# Altium project Gamebuino.PrjPcb
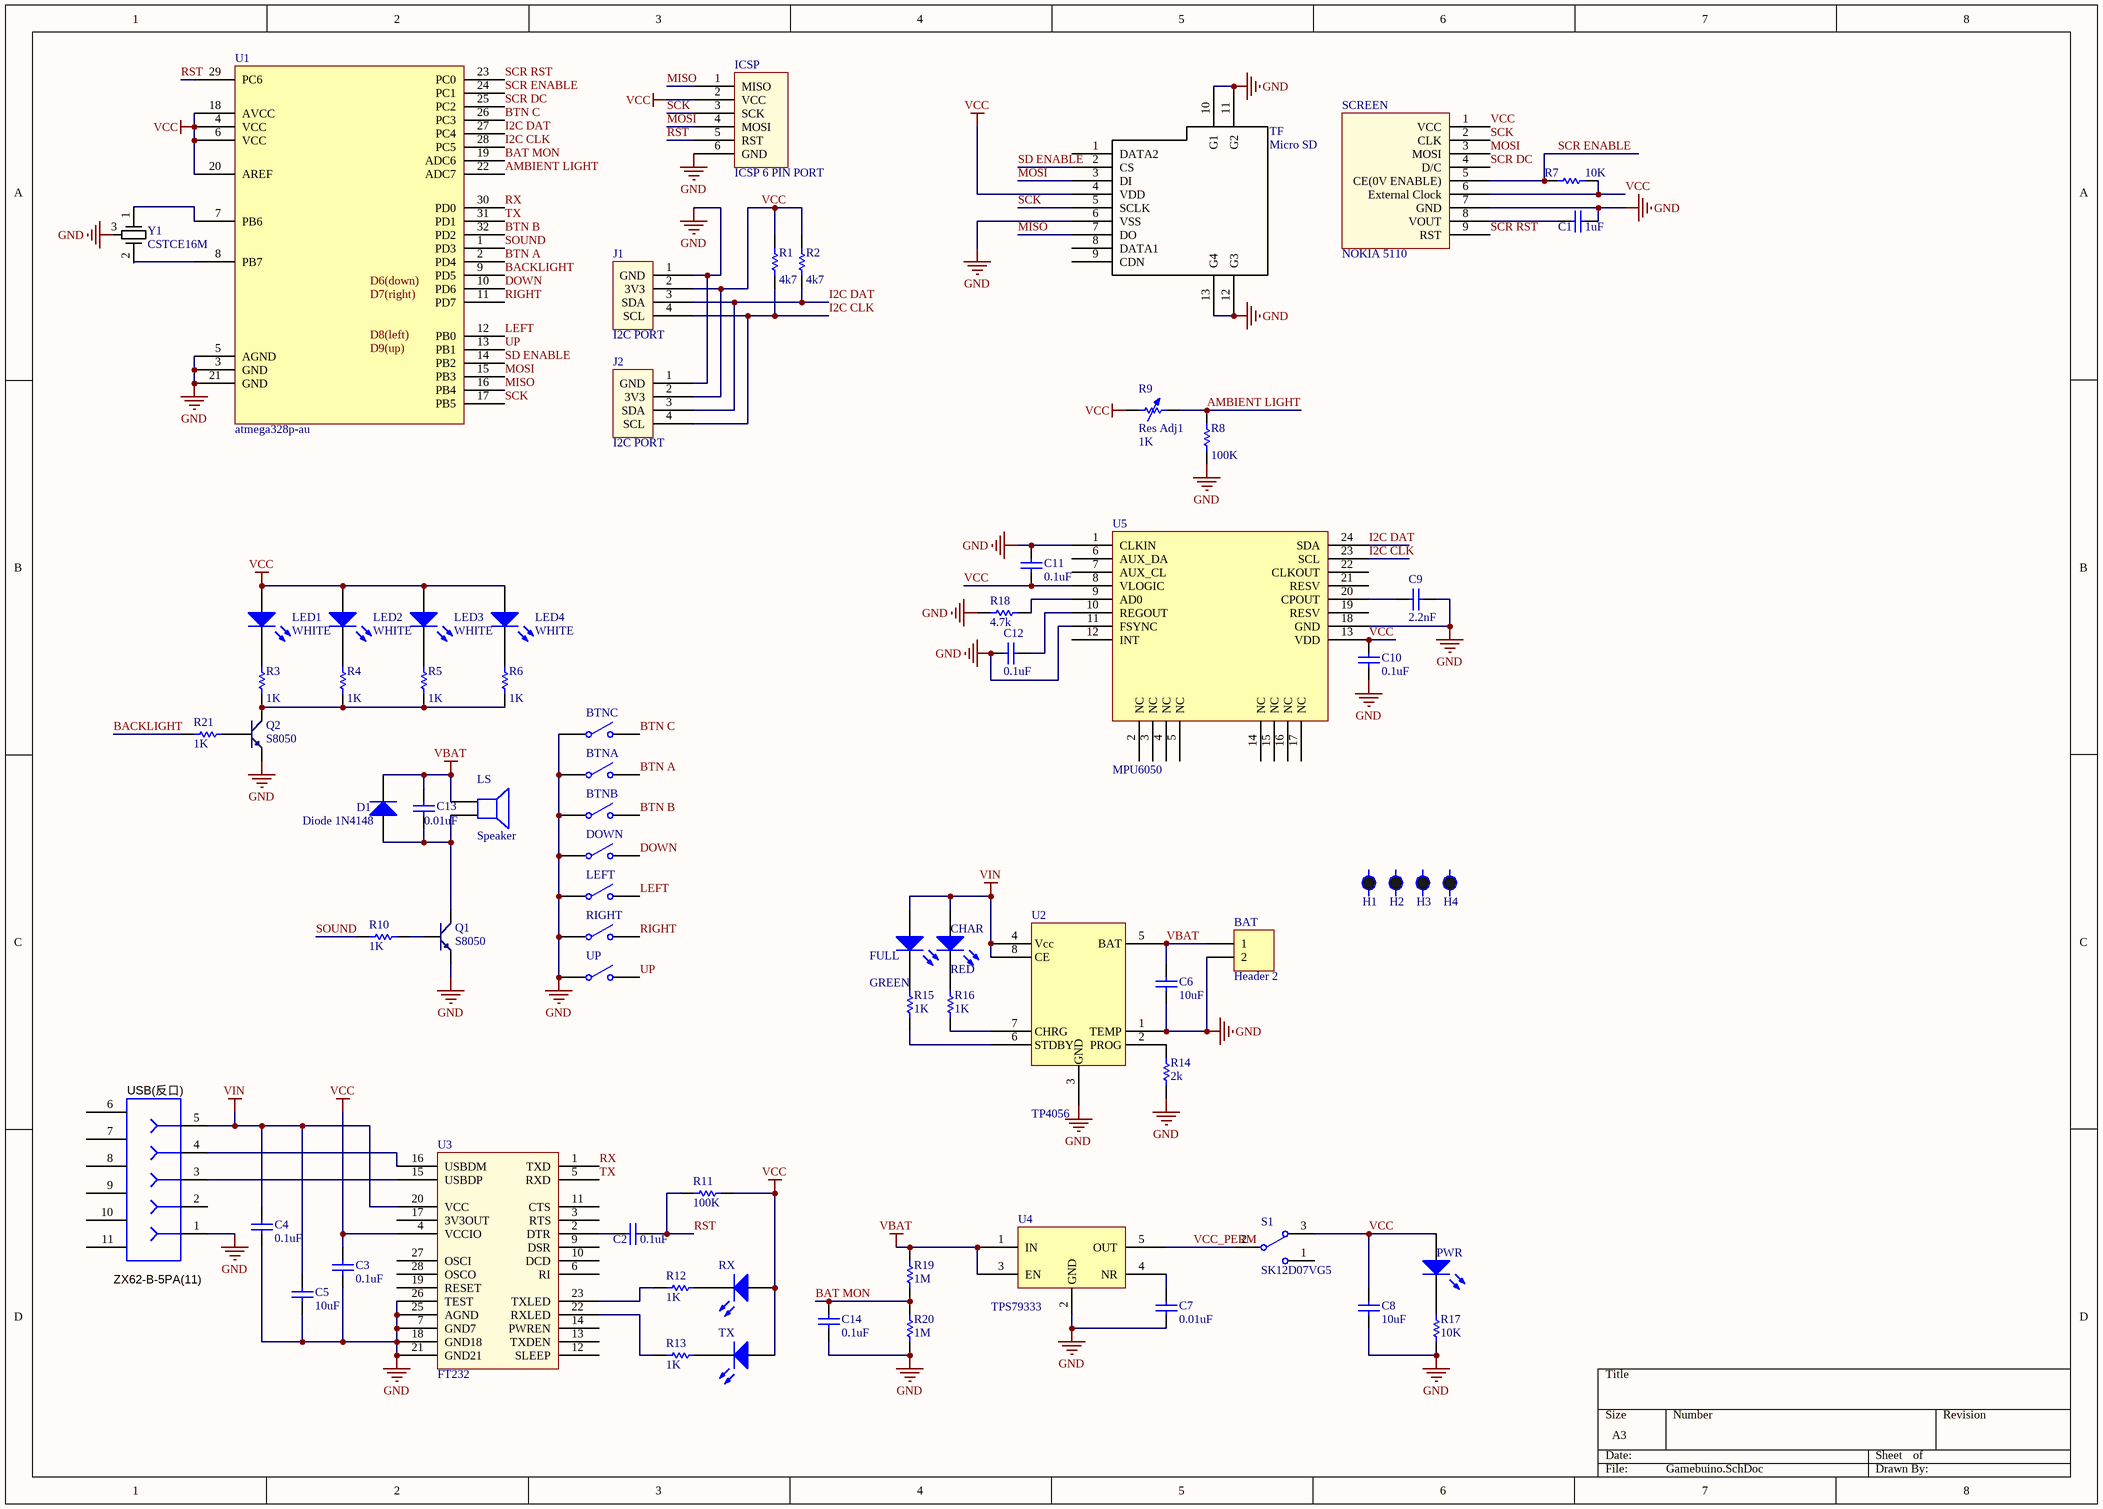
[diagram p0: Gamebuino.SchDoc]
1 sheet, 73 parts. Net scope: global (net labels, ports and power ports of the same name join across sheets).
Board file: Gamebuino.PcbDoc

## Sheet Gamebuino.SchDoc
size A3

### Parts
BAT  Header 2  [BAT]
BTNA  SW-SPST  [KEY5]  (value not drawn)
BTNB  SW-SPST  [KEY5]  (value not drawn)
BTNC  SW-SPST  [KEY5]  (value not drawn)
C1  value 1uF  [6-0805_N]  (hidden comment: Cap)
C2  value 0.1uF  [6-0805_N]  (hidden comment: Cap)
C3  value 0.1uF  [6-0805_N]  (hidden comment: Cap)
C4  value 0.1uF  [6-0805_N]  (hidden comment: Cap)
C5  value 10uF  [6-0805_N]  (hidden comment: Cap)
C6  value 10uF  [6-0805_N]  (hidden comment: Cap)
C7  value 0.01uF  [6-0805_N]  (hidden comment: Cap)
C8  value 10uF  [6-0805_N]  (hidden comment: Cap)
C9  value 2.2nF  [6-0805_N]  (hidden comment: Cap)
C10  value 0.1uF  [6-0805_N]  (hidden comment: Cap)
C11  value 0.1uF  [6-0805_N]  (hidden comment: Cap)
C12  value 0.1uF  [6-0805_N]  (hidden comment: Cap)
C13  value 0.01uF  [6-0805_N]  (hidden comment: Cap)
C14  value 0.1uF  [6-0805_N]  (hidden comment: Cap)
CHAR  RED  [6-0805_N]
D1  Diode 1N4148  [12Z-2010]
DOWN  SW-SPST  [KEY5]  (value not drawn)
FULL  GREEN  [6-0805_N]
H1  HOLE  [HOLE_3.0]  (value not drawn)
H2  HOLE  [HOLE_3.0]  (value not drawn)
H3  HOLE  [HOLE_3.0]  (value not drawn)
H4  HOLE  [HOLE_3.0]  (value not drawn)
ICSP  ICSP 6 PIN PORT  [CONN6-1mm]
J1  I2C PORT  [CONN4_/wTestPoint]
J2  I2C PORT  [CONN4_/wTestPoint]
LED1  WHITE  [6-0805_N]
LED2  WHITE  [6-0805_N]
LED3  WHITE  [6-0805_N]
LED4  WHITE  [6-0805_N]
LEFT  SW-SPST  [KEY5]  (value not drawn)
LS  Speaker  [Speaker]
PWR  LED0  [6-0805_N]  (value not drawn)
Q1  S8050  [SOT-23R]
Q2  S8050  [SOT-23R]
R1  value 4k7  [6-0805_N]  (hidden comment: Res1)
R2  value 4k7  [6-0805_N]  (hidden comment: Res1)
R3  value 1K  [6-0805_N]  (hidden comment: Res1)
R4  value 1K  [6-0805_N]  (hidden comment: Res1)
R5  value 1K  [6-0805_N]  (hidden comment: Res1)
R6  value 1K  [6-0805_N]  (hidden comment: Res1)
R7  value 10K  [6-0805_N]  (hidden comment: Res1)
R8  value 100K  [6-0805_N]  (hidden comment: Res1)
R9  Res Adj1  value 1K  [light_sensor]
R10  value 1K  [6-0805_N]  (hidden comment: Res1)
R11  value 100K  [6-0805_N]  (hidden comment: Res1)
R12  value 1K  [6-0805_N]  (hidden comment: Res1)
R13  value 1K  [6-0805_N]  (hidden comment: Res1)
R14  value 2k  [6-0805_N]  (hidden comment: Res1)
R15  value 1K  [6-0805_N]  (hidden comment: Res1)
R16  value 1K  [6-0805_N]  (hidden comment: Res1)
R17  value 10K  [6-0805_N]  (hidden comment: Res1)
R18  value 4.7k  [6-0805_N]  (hidden comment: Res1)
R19  value 1M  [6-0805_N]  (hidden comment: Res1)
R20  value 1M  [6-0805_N]  (hidden comment: Res1)
R21  value 1K  [6-0805_N]  (hidden comment: Res1)
RIGHT  SW-SPST  [KEY5]  (value not drawn)
RX  LED0  [6-0805_N]  (value not drawn)
S1  SK12D07VG5  [DIP10]
SCREEN  NOKIA 5110  [5110_bare]
TF  Micro SD  [tf]
TX  LED0  [6-0805_N]  (value not drawn)
U1  atmega328p-au  [TQFP-32N-1]
U2  TP4056  [SOP-PP-8]
U3  FT232  [LC-SSOP-28_208mil]
U4  TPS79333  [SOT-23-5]
U5  MPU6050  [QFN-24A]
UP  SW-SPST  [KEY5]  (value not drawn)
USB(反口)  ZX62-B-5PA(11)  [CONN_USB_micro_ZX62-B-5PA]
Y1  CSTCE16M  [cstce8m]

### Nets
GND: BAT.2 BTNA.1(COMMON) BTNB.1(COMMON) BTNC.1(COMMON) C1.2 C3.1 C4.1 C5.1 C6.1 C7.1 C8.1 C9.1 C10.1 C11.2 C12.2 C14.2 DOWN.1(COMMON) ICSP.6(GND) J1.1(GND) J2.1(GND) LEFT.1(COMMON) Q1.1(E) Q2.1(E) R8.1 R14.2 R17.2 R18.1 R20.1 RIGHT.1(COMMON) SCREEN.7(GND) TF.6(VSS) TF.10(G1) TF.11(G2) TF.12(G3) TF.13(G4) U1.3(GND) U1.5(AGND) U1.21(GND) U2.1(TEMP) U2.3(GND) U3.7(GND7) U3.18(GND18) U3.21(GND21) U3.25(AGND) U3.26(TEST) U4.2(GND) U5.1(CLKIN) U5.11(FSYNC) U5.18(GND) UP.1(COMMON) USB(反口).1 Y1.3
VBAT: BAT.1 C6.2 C13.1 D1.2(K) LS.1 R19.2 U2.5(BAT) U4.1(IN) U4.3(EN)
VCC: C3.2 C8.2 C10.2 C11.1 ICSP.2(VCC) J1.2(3V3) J2.2(3V3) LED1.1(A) LED2.1(A) LED3.1(A) LED4.1(A) PWR.1(A) R1.2 R2.2 R7.1 R9.1 R11.1 RX.1(A) S1.3 SCREEN.1(VCC) SCREEN.6(External_Clock) TF.4(VDD) TX.1(A) U1.4(VCC) U1.6(VCC) U1.18(AVCC) U1.20(AREF) U3.4(VCCIO) U5.8(VLOGIC) U5.13(VDD)
VIN: C4.2 C5.2 CHAR.1(A) FULL.1(A) U2.4(Vcc) U2.8(CE) U3.20(VCC) USB(反口).5
AMBIENT LIGHT: R8.2 R9.2 U1.22(ADC7)
BACKLIGHT: R21.1 U1.9(PD5)
BAT MON: C14.1 R19.1 R20.2 U1.19(ADC6)
BTN A: BTNA.2(NO) U1.2(PD4)
BTN B: BTNB.2(NO) U1.32(PD2)
BTN C: BTNC.2(NO) U1.26(PC3)
DOWN: DOWN.2(NO) U1.10(PD6)
I2C CLK: J1.4(SCL) J2.4(SCL) R1.1 U1.28(PC5) U5.23(SCL)
I2C DAT: J1.3(SDA) J2.3(SDA) R2.1 U1.27(PC4) U5.24(SDA)
LEFT: LEFT.2(NO) U1.12(PB0)
MISO: ICSP.1(MISO) TF.7(DO) U1.16(PB4)
MOSI: ICSP.4(MOSI) SCREEN.3(MOSI) TF.3(DI) U1.15(PB3)
RIGHT: RIGHT.2(NO) U1.11(PD7)
RST: C2.2 ICSP.5(RST) R11.2 U1.29(PC6)
RX: U1.30(PD0) U3.1(TXD)
SCK: ICSP.3(SCK) SCREEN.2(CLK) TF.5(SCLK) U1.17(PB5)
SCR DC: SCREEN.4(D/C) U1.25(PC2)
SCR ENABLE: R7.2 SCREEN.5(CE(0V_ENABLE)) U1.24(PC1)
SCR RST: SCREEN.9(RST) U1.23(PC0)
SD ENABLE: TF.2(CS) U1.14(PB2)
SOUND: R10.2 U1.1(PD3)
TX: U1.31(PD1) U3.5(RXD)
UP: U1.13(PB1) UP.2(NO)
VCC_PERM: S1.2 U4.5(OUT)
NetC1_1: C1.1 SCREEN.8(VOUT)
NetC2_1: C2.1 U3.2(DTR)
NetC7_2: C7.2 U4.4(NR)
NetC9_2: C9.2 U5.20(CPOUT)
NetC12_1: C12.1 U5.10(REGOUT)
NetC13_2: C13.2 D1.1(A) LS.2 Q1.3(C)
NetCHAR_2: CHAR.2(K) R16.1
NetFULL_2: FULL.2(K) R15.1
NetLED1_2: LED1.2(K) R3.2
NetLED2_2: LED2.2(K) R4.2
NetLED3_2: LED3.2(K) R5.2
NetLED4_2: LED4.2(K) R6.2
NetPWR_2: PWR.2(K) R17.1
NetQ1_2: Q1.2(B) R10.1
NetQ2_2: Q2.2(B) R21.2
NetQ2_3: Q2.3(C) R3.1 R4.1 R5.1 R6.1
NetR12_1: R12.1 RX.2(K)
NetR12_2: R12.2 U3.23(TXLED)
NetR13_1: R13.1 TX.2(K)
NetR13_2: R13.2 U3.22(RXLED)
NetR14_1: R14.1 U2.2(PROG)
NetR15_2: R15.2 U2.6(STDBY)
NetR16_2: R16.2 U2.7(CHRG)
NetR18_2: R18.2 U5.9(AD0)
NetU1_7: U1.7(PB6) Y1.1
NetU1_8: U1.8(PB7) Y1.2
NetU3_15: U3.15(USBDP) USB(反口).3
NetU3_16: U3.16(USBDM) USB(反口).4

Not connected (* = marked no-connect by the designer): S1 1; TF 1(DATA2) 8(DATA1) 9(CDN); U3 3(RTS) 6(RI) 9(DSR) 10(DCD) 11(CTS) 12(SLEEP) 13(TXDEN) 14(PWREN) 17(3V3OUT) 19(RESET) 27(OSCI) 28(OSCO); U5 2(NC) 3(NC) 4(NC) 5(NC) 6(AUX_DA) 7(AUX_CL) 12(INT) 14(NC) 15(NC) 16(NC) 17(NC) 19(RESV) 21(RESV) 22(CLKOUT); USB(反口) 2 6 7 8 9 10 11

### Notes on the sheet
- Labels drawn without touching a wire or pin: D6(down), D7(right), D8(left), D9(up)

### Library data of the parts
BAT = Header 2: Header, 2-Pin; LatestRevisionDate: 17-Jul-2002; LatestRevisionNote: Re-released for DXP Platform.; Publisher: Altium Limited
BTNA BTNB BTNC DOWN LEFT RIGHT UP = SW-SPST: Single-Pole, Single-Throw Switch; Published: 24-Mar-1999; LatestRevisionDate: 17-Jul-2002; LatestRevisionNote: Re-released for DXP Platform.; PackageReference: SPST-2; Publisher: Altium Limited; PackageDescription: Switch; 2 Leads
C1-C14 = Cap: Capacitor; Published: 8-Jun-2000; LatestRevisionDate: 17-Jul-2002; LatestRevisionNote: Re-released for DXP Platform.; PackageReference: RAD-0.3; Publisher: Altium Limited; PackageDescription: Radial Cap, Thru-Hole; 2 Leads; 0.3 in Pin Spacing
CHAR FULL LED1-LED4 PWR RX TX = LED0: Typical INFRARED GaAs LED; Published: 8-Jun-2000; LatestRevisionDate: 08-Jul-2005; LatestRevisionNote: Mech Layer 1 removed.; PackageReference: LED-0; Publisher: Altium Limited; PackageDescription: LED; 2 Leads
D1 = Diode 1N4148: High Conductance Fast Diode; Published: 8-Jun-2000; LatestRevisionDate: 17-Jul-2002; LatestRevisionNote: Re-released for DXP Platform.; DatasheetVersion: 1997; PackageReference: DO-35; Publisher: Altium Limited; PackageDescription: Diode, Axial; Body 3.8 x 1.9 mm (LxDia. max), Lead Dia. 0.53 mm (max); Code_JEDEC: DO-204-AH; ComponentLink1Description: Manufacturer Link; ComponentLink1URL: http://www.fairchildsemi.com/; ComponentLink2Description: Datasheet; ComponentLink2URL: http://www.fairchildsemi.com/ds/1N%2F1N4148.pdf
ICSP = ICSP
J1 J2 = Component_1
LS = Speaker: Loudspeaker; Published: 24-Mar-1999; LatestRevisionDate: 17-Jul-2002; LatestRevisionNote: Re-released for DXP Platform.; PackageReference: PIN2; Publisher: Altium Limited
Q1 Q2 = NPN: 8050/BCW846/BCW847
R1-R8 R10-R21 = Res1: Resistor; Published: 8-Jun-2000; LatestRevisionDate: 17-Jul-2002; LatestRevisionNote: Re-released for DXP Platform.; PackageReference: AXIAL-0.3; Publisher: Altium Limited; PackageDescription: Axial Device, Thru-Hole; 2 Leads; 0.3 in Pin Spacing
R9 = Res Adj1: Variable Resistor; Set Position: 0.5; Published: 8-Jun-2000; LatestRevisionDate: 17-Jul-2002; LatestRevisionNote: Re-released for DXP Platform.; PackageReference: AXIAL-0.7; Publisher: Altium Limited; PackageDescription: Axial Device, Thru-Hole; 2 Leads; 0.7 in Pin Spacing
S1 = SW-SPDT: SPDT Subminiature Toggle Switch, Right Angle Mounting, Vertical Actuation; Published: 24-Mar-1999; LatestRevisionDate: 17-Dec-2003; LatestRevisionNote: Schematic revised, PCB Footprint replaced.; DatasheetVersion: 05-Dec-2000; PackageReference: TL36WW15050; Publisher: Altium Limited; PackageDescription: Switch; 4 Leads; ComponentLink1Description: Manufacturer Link; ComponentLink1URL: http://www.apem.com
USB(反口) = ZX62M-B-5P: Connector, micro USB Type B, Receptacle, R/A, SMD; Manufacturer: Hirose Electric Co. Ltd.; SymbolCreator: a0411947; U/M: EA; DNP: false; SymbolVersion: 2013-04-05; PartNumber: ZX62-B-5PA(11); PackageReference: Micro USB-B receptacle; CompType: Receptacle; RoHS: Y; MountType: SMT; ComponentLink1Description: Datasheet Link; ComponentLink1URL: http://www.hirose.co.jp/cataloge_hp/e24200011.pdf; Publisher: Texas Instruments; LatestRevisionDate: 2013-11-19; Supplier 1: Digi-Key; Supplier Part Number 1: H11634CT-ND; Supplier 2: Mouser; Supplier Part Number 2: 798-ZX62-B-5PA11; Supplier 3: Farnell; Supplier Part Number 3: 1645325
Y1 = cstce8m